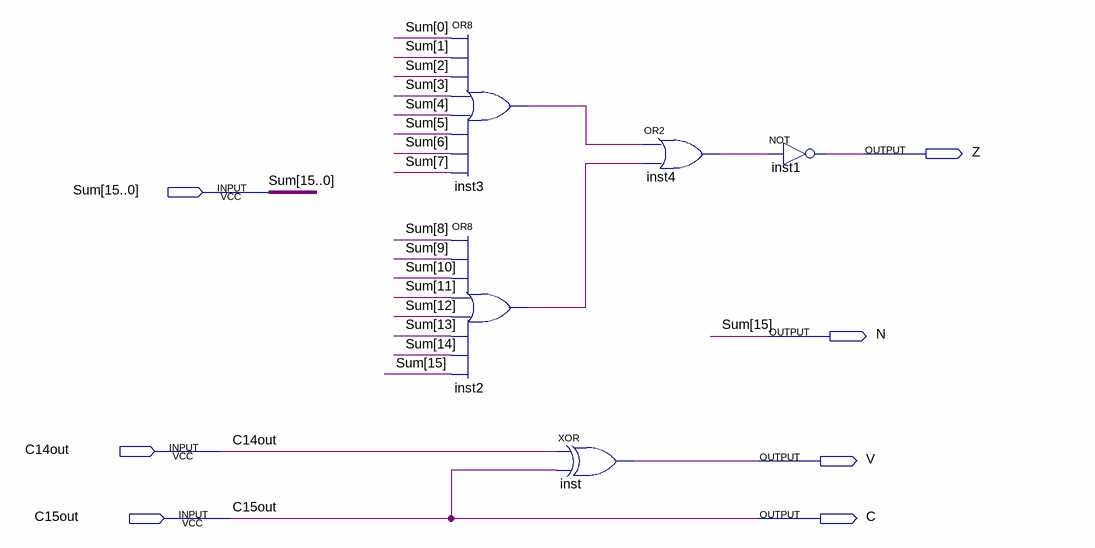
[diagram p0: schematic sheet]
// Quartus schematic ResultFlags.bdf as structural Verilog: 5 symbols, 7 pins
module ResultFlags (
  input  [15:0] Sum,
  input  C14out,
  input  C15out,
  output Z,
  output N,
  output V,
  output C
);

  wire inst2_out, inst3_out, inst4_out;

  or inst3 (inst3_out, Sum[0], Sum[1], Sum[2], Sum[3], Sum[4], Sum[5], Sum[6], Sum[7]);
  or inst2 (inst2_out, Sum[8], Sum[9], Sum[10], Sum[11], Sum[12], Sum[13], Sum[14], Sum[15]);
  xor inst (V, C14out, C15out);
  or inst4 (inst4_out, inst3_out, inst2_out);
  not inst1 (Z, inst4_out);

  assign C = C15out;
  assign N = Sum[15];
endmodule
